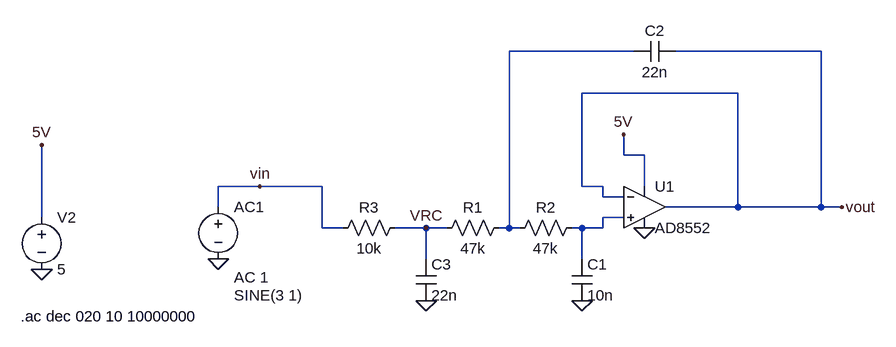
[diagram p0: schematic LPF.asc]
LPF.asc, the LTspice schematic file:
Version 4.1
SHEET 1 884 748
WIRE 240 -64 48 -64
WIRE 528 -64 304 -64
WIRE 400 0 160 0
WIRE 224 96 224 64
WIRE 256 96 224 96
WIRE -336 144 -400 144
WIRE -240 144 -336 144
WIRE 160 144 160 0
WIRE 192 144 160 144
WIRE 256 144 256 96
WIRE 192 160 192 144
WIRE 224 160 192 160
WIRE -400 176 -400 144
WIRE 400 176 400 0
WIRE 400 176 288 176
WIRE 528 176 528 -64
WIRE 528 176 400 176
WIRE 560 176 528 176
WIRE -672 192 -672 80
WIRE 224 192 192 192
WIRE -240 208 -240 144
WIRE -208 208 -240 208
WIRE -80 208 -128 208
WIRE -48 208 -80 208
WIRE 48 208 48 -64
WIRE 48 208 32 208
WIRE 64 208 48 208
WIRE 160 208 144 208
WIRE 192 208 192 192
WIRE 192 208 160 208
WIRE -80 256 -80 208
WIRE 160 256 160 208
FLAG -672 272 0
FLAG -672 80 5V
FLAG -400 256 0
FLAG 160 320 0
FLAG 256 208 0
FLAG 224 64 5V
FLAG 560 176 vout
FLAG -336 144 vin
FLAG -80 320 0
FLAG -80 208 VRC
SYMBOL voltage -400 160 R0
WINDOW 3 24 152 Left 2
WINDOW 123 24 124 Left 2
WINDOW 39 0 0 Left 0
SYMATTR Value SINE(3 1)
SYMATTR Value2 AC 1
SYMATTR InstName AC1
SYMBOL voltage -672 176 R0
WINDOW 123 0 0 Left 0
WINDOW 39 0 0 Left 0
SYMATTR InstName V2
SYMATTR Value 5
SYMBOL res -112 192 R90
WINDOW 0 0 56 VBottom 2
WINDOW 3 32 56 VTop 2
SYMATTR InstName R3
SYMATTR Value 10k
SYMBOL cap -96 256 R0
SYMATTR InstName C3
SYMATTR Value 22n
SYMBOL res 48 192 R90
WINDOW 0 0 56 VBottom 2
WINDOW 3 32 56 VTop 2
SYMATTR InstName R1
SYMATTR Value 47k
SYMBOL res 160 192 R90
WINDOW 0 0 56 VBottom 2
WINDOW 3 32 56 VTop 2
SYMATTR InstName R2
SYMATTR Value 47k
SYMBOL cap 144 256 R0
SYMATTR InstName C1
SYMATTR Value 10n
SYMBOL cap 304 -80 R90
WINDOW 0 0 32 VBottom 2
WINDOW 3 32 32 VTop 2
SYMATTR InstName C2
SYMATTR Value 22n
SYMBOL OpAmps\\AD8552 256 112 R0
SYMATTR InstName U1
TEXT -704 344 Left 2 !.ac dec 020 10 10000000

The netlist it stands for:
* LPF.asc
V§AC1 vin 0 SINE(3 1) AC 1
V2 5V 0 5
R3 VRC vin 10k
C3 VRC 0 22n
R1 N001 VRC 47k
R2 N002 N001 47k
C1 N002 0 10n
C2 vout N001 22n
X§U1 N002 vout 5V 0 vout AD8552  ; pins In+ In- V+ V- OUT
.ac dec 020 10 10000000
.backanno
.end